# Altium project sonata-board.PrjPcb (part 2 of 4)

## Sheet sb-sonata-debug.SchDoc: FTDI Interface (Debug Programming)
size Letter; Organization: NewAE Technology Inc.; Address1: 1083 Queen St., Suite 196; Address2: Halifax; Address3: NS; Address4: Canada B3H 0B2; SheetNumber: 7; SheetTotal: 20; SheetApproved: NO
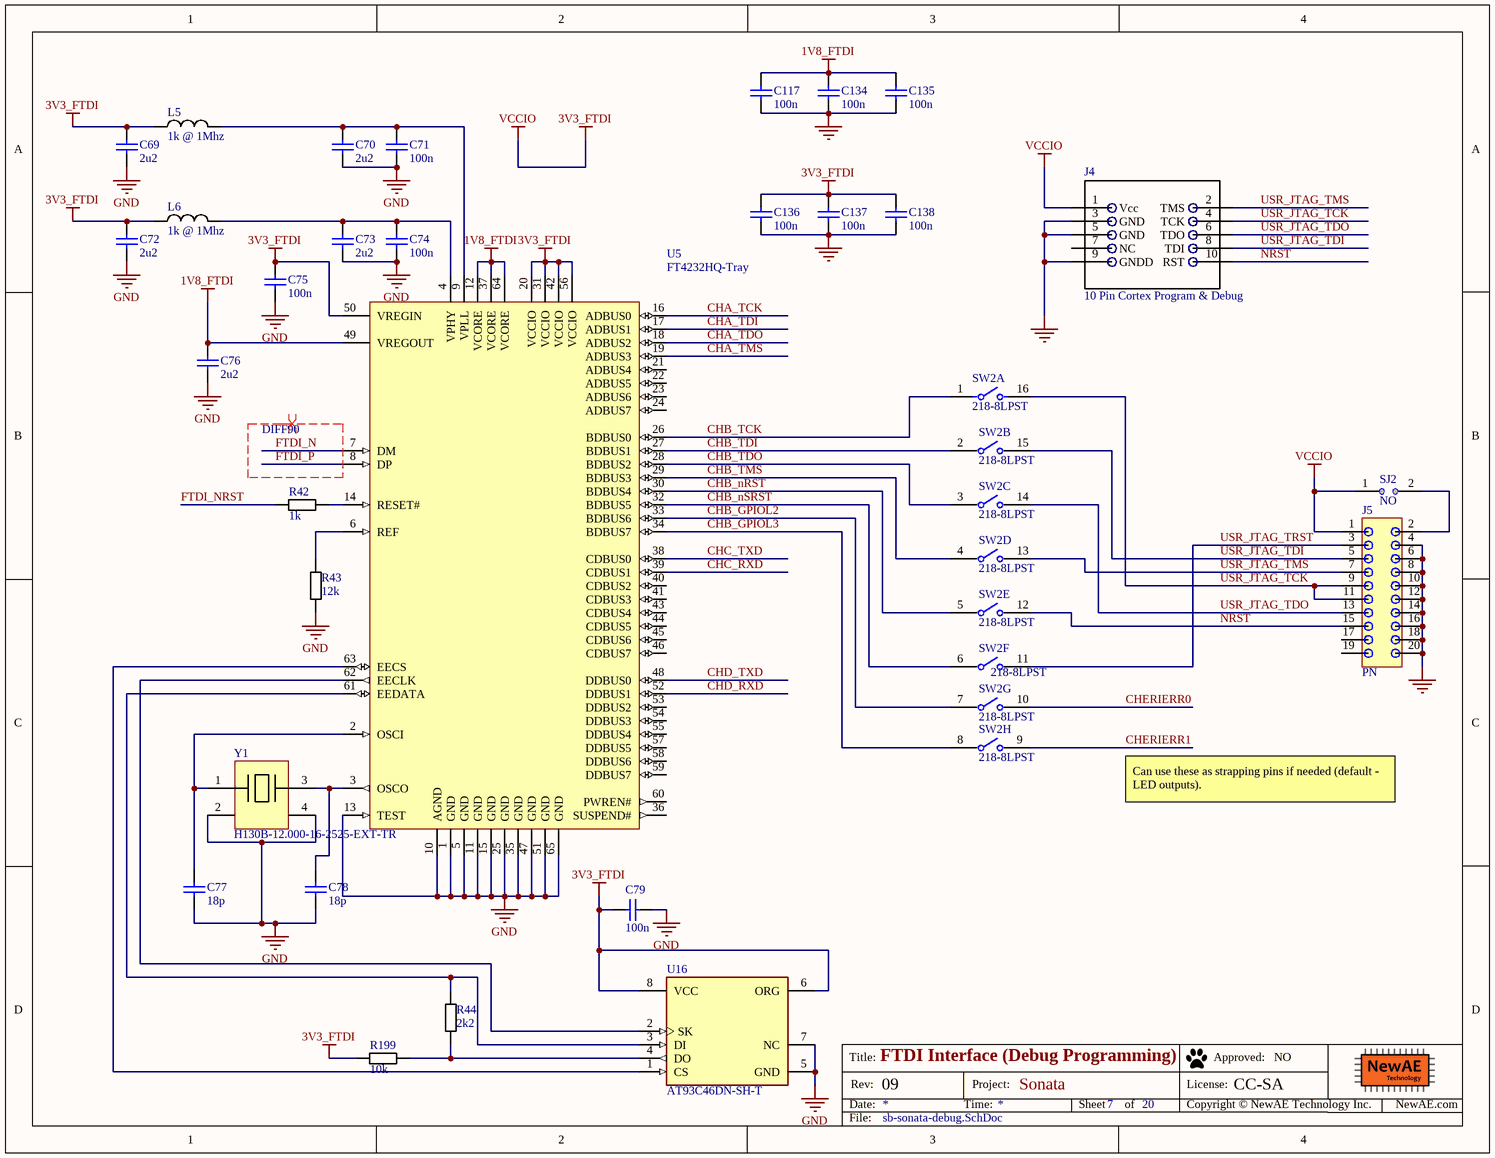
[diagram p6: sb-sonata-debug.SchDoc]

### Parts
C69  2u2  [CAPC0603_M]
C70  2u2  [CAPC0603_M]
C71  100n  [CAPC0402_M]
C72  2u2  [CAPC0603_M]
C73  2u2  [CAPC0603_M]
C74  100n  [CAPC0402_M]
C75  100n  [CAPC0402_M]
C76  2u2  [CAPC0603_M]
C77  18p  [CAPC0402_M]
C78  18p  [CAPC0402_M]
C79  100n  [CAPC0402_M]
C117  100n  [CAPC0402_M]
C134  100n  [CAPC0402_M]
C135  100n  [CAPC0402_M]
C136  100n  [CAPC0402_M]
C137  100n  [CAPC0402_M]
C138  100n  [CAPC0402_M]
J4  10 Pin Cortex Program & Debug  [0.5mm_SMD_Header_5x2]
J5  PN  [CONN_10x2_SHROUDED_2.54mm]
L5  1k @ 1Mhz  [IND_0603]
L6  1k @ 1Mhz  [IND_0603]
R42  1k  [RESC1005X40N]
R43  12k  [RESC1608X55N]
R44  2k2  [RESC1005X40N]
R199  10k  [RESC1005X40N]
SJ2  NO  [SJ_2S_NO]  (no BOM)
SW2  218-8LPST  [FP-218-8LPST-MFG]  (parts A,B,C,D,E,F,G,H of 8)
U5  FT4232HQ-Tray  [QFN64_2_N]
U16  AT93C46DN-SH-T  [FP-C04-057-SN-MFG]
Y1  H130B-12.000-16-2525-EXT-TR  [5x3.2MM XTAL]

### Nets
1V8_FTDI: C76.1 C117.1 C134.1 C135.1 U5.12(VCORE) U5.37(VCORE) U5.49(VREGOUT) U5.64(VCORE)
3V3_FTDI: C69.1 C72.1 C75.1 C79.1 C136.1 C137.1 C138.1 J4.1(Vcc) J5.1 L5.1 L6.1 R199.1 SJ2.1 U5.20(VCCIO) U5.31(VCCIO) U5.42(VCCIO) U5.50(VREGIN) U5.56(VCCIO) U16.6(ORG) U16.8(VCC)  [also labelled VCCIO]
GND: C69.2 C70.2 C71.2 C72.2 C73.2 C74.2 C75.2 C76.2 C77.2 C78.2 C79.2 C117.2 C134.2 C135.2 C136.2 C137.2 C138.2 J4.3(GND) J4.5(GND) J4.9(GNDD) J5.4 J5.6 J5.8 J5.10 J5.12 J5.14 J5.16 J5.18 J5.20 R43.2 U5.1(GND) U5.5(GND) U5.10(AGND) U5.11(GND) U5.13(TEST) U5.15(GND) U5.25(GND) U5.35(GND) U5.47(GND) U5.51(GND) U5.65(GND) U16.5(GND) U16.7(NC) Y1.2 Y1.4
CHA_TCK: U5.16(ADBUS0)
CHA_TDI: U5.17(ADBUS1)
CHA_TDO: U5.18(ADBUS2)
CHA_TMS: U5.19(ADBUS3)
CHB_GPIOL2: SW2.7 U5.33(BDBUS6)
CHB_GPIOL3: SW2.8 U5.34(BDBUS7)
CHB_nRST: SW2.5 U5.30(BDBUS4)
CHB_nSRST: SW2.6 U5.32(BDBUS5)
CHB_TCK: SW2.1 U5.26(BDBUS0)
CHB_TDI: SW2.2 U5.27(BDBUS1)
CHB_TDO: SW2.3 U5.28(BDBUS2)
CHB_TMS: SW2.4 U5.29(BDBUS3)
CHC_RXD: U5.39(CDBUS1)
CHC_TXD: U5.38(CDBUS0)
CHD_RXD: U5.52(DDBUS1)
CHD_TXD: U5.48(DDBUS0)
CHERIERR0: SW2.10
CHERIERR1: SW2.9
FTDI_N: U5.7(DM)
FTDI_NRST: R42.2
FTDI_P: U5.8(DP)
NRST: J4.10(RST) J5.15 SW2.12
USR_JTAG_TCK: J4.4(TCK) J5.9 J5.11 SW2.16
USR_JTAG_TDI: J4.8(TDI) J5.5 SW2.15
USR_JTAG_TDO: J4.6(TDO) J5.13 SW2.14
USR_JTAG_TMS: J4.2(TMS) J5.7 SW2.13
USR_JTAG_TRST: J5.3 SW2.11
NetC70_1: C70.1 C71.1 L5.2 U5.9(VPLL)
NetC73_1: C73.1 C74.1 L6.2 U5.4(VPHY)
NetC77_1: C77.1 U5.2(OSCI) Y1.1
NetC78_1: C78.1 U5.3(OSCO) Y1.3
NetJ5_2: J5.2 SJ2.2
NetR42_1: R42.1 U5.14(RESET#)
NetR43_1: R43.1 U5.6(REF)
NetR44_1: R44.1 U5.61(EEDATA) U16.3(DI)
NetR44_2: R44.2 R199.2 U16.4(DO)
NetU5_62: U5.62(EECLK) U16.2(SK)
NetU5_63: U5.63(EECS) U16.1(CS)

Not connected (* = marked no-connect by the designer): J4 7(NC); J5 17(9) 19(9); U5 21(ADBUS4) 22(ADBUS5) 23(ADBUS6) 24(ADBUS7) 36(SUSPEND#) 40(CDBUS2) 41(CDBUS3) 43(CDBUS4) 44(CDBUS5) 45(CDBUS6) 46(CDBUS7) 53(DDBUS2) 54(DDBUS3) 55(DDBUS4) 57(DDBUS5) 58(DDBUS6) 59(DDBUS7) 60(PWREN#)

### Layout directives
differential pair; differential pair class DIFF90: FTDI_N, FTDI_P

### Notes on the sheet
- Can use these as strapping pins if needed (default - LED outputs).
- Title:
- Date:
- Rev:
- Time:
- Project:
- Sheet
- of
- License:
- Copyright © NewAE Technology Inc.
- Approved:
- NewAE.com
- File:

### Library data of the parts
C69 C70 C72 C73 C76 = CCHIP-2u2-0603: 2u2, 0603; Manufacture 1: Samsung; Manufacture Part Number 1: CL10B225KP8NNNC; Component Group: Capacitor; Case-EIA: 0603; Case-Metric: 1608; Rated Voltage: 10VDC; Part Number: CCHIP-2u2-0603; Footprint: 0603; Pin Count: 2; Supplier 1: Digi-Key; Supplier Part Number 1: 1276-1134-1-ND; Value: 2u2; Mounting Technology: SMT; Component Kind: Standard; Component Type: Standard
C71 C74 C75 C79 C117 C134-C138 = CCHIP-100n-0402: as C4 on sheet sb-sonata-usb; Part Number: CCHIP-100n-0402; Footprint: 0402; Pin Count: 2; Supplier 1: Digi-Key; Supplier Part Number 1: 445-6901-1-ND; Value: 100n; Mounting Technology: SMT; Component Kind: Standard; Component Type: Standard
C77 C78 = CCHIP-18p-0402: 18p, 0402; Manufacture Part Number 1: GRM1555C1H180JA01D; Component Group: Capacitor; Case-EIA: 0402; Part Number: CCHIP-18p-0402; Footprint: 0402; Pin Count: 2; Supplier 1: Digi-Key; Supplier Part Number 1: 490-5858-1-ND; Value: 18p; Mounting Technology: SMT; Component Kind: Standard; Component Type: Standard
J4 = Cortex_Debug_Header_10Pin: 10 Pin Cortex Program & Debug 0.5mm pitch; Manufacture Part Number 1: 20021121-00010C4LF; Component Group: Connector; PP Material Stack: 0; Part Number: Cortex_Debug_Header_10Pin; Pin Count: 10; Supplier 1: Digi-Key; Supplier Part Number 1: 609-3695-1-ND; Mounting Technology: SMT; RoHS: Yes; Component Kind: Standard; Component Type: Standard; PP Rotation: 0
J5 = CONN20_2ROW: Header, 2-Row, 20-pin, 0.1"; Component Group: Connector; Part Number: CONN20_2ROW; Pin Count: 20; Mounting Technology: SMT; Component Kind: Standard; Component Type: Standard
L5 L6 = FBCHIP-1k-0603: Ferrite Beads HI CUR CHIP BD 0603 1000OHMS 25%; Manufacture 1: Taiyo Yuden; Manufacture Part Number 1: FBMH1608HM102-T / FBMH1608HM102-T / FBMH1608HM102-T / FBMH1608HM102-T; Component Group: Inductor; PP Material Stack: 0; Part Number: FBCHIP-1k-0603; Footprint: 0603; Pin Count: 2; Supplier 1: Mouser; Supplier Part Number 1: 963-FBMH1608HM102-T; Mounting Technology: SMT; RoHS: Yes; Component Kind: Standard; Component Type: Standard; PP Rotation: 0
R42 = RCHIP-1K-0402: 1k res, 0402, 1%, 1/16W; Manufacture 1: Yageo; Manufacture Part Number 1: RC0402FR-071KL; Component Group: Resistor; Case-EIA: 0402; Case-Metric: 1005; Rated Power: 0.063W; Rated Voltage: 75VDC; Part Number: RCHIP-1K-0402; Footprint: 0402; Pin Count: 2; Supplier 1: Digi-Key; Supplier Part Number 1: 311-1.00KLRCT-ND; Value: 1k; Tolerance: 1%; Mounting Technology: SMT; Temperature Range: -55C to 155C; Component Kind: Standard; Component Type: Standard
R43 = RCHIP-12K-0603: 12k res, 0603, 1%, 1/10W; Manufacture 1: Yageo; Manufacture Part Number 1: RC0603FR-0712KL; Component Group: Resistor; Case-EIA: 0603; Case-Metric: 1608; Rated Power: 0.1W; Rated Voltage: 75VDC; Part Number: RCHIP-12K-0603; Footprint: 0603; Pin Count: 2; Supplier 1: Digi-Key; Supplier Part Number 1: 311-12.0KHRCT-ND; Value: 12k; Tolerance: 1%; Mounting Technology: SMT; Temperature Range: -55C to 155C; Component Kind: Standard; Component Type: Standard
R44 = RCHIP-2K2-0402: 2k2 res, 0402, 1%, 1/16W; Manufacture 1: Yageo; Manufacture Part Number 1: RC0402FR-072K2L; Component Group: Resistor; Case-EIA: 0402; Case-Metric: 1005; Rated Power: 0.063W; Rated Voltage: 75VDC; Part Number: RCHIP-2K2-0402; Footprint: 0402; Pin Count: 2; Supplier 1: Digi-Key; Supplier Part Number 1: 311-2.20KLRCT-ND; Value: 2k2; Tolerance: 1%; Mounting Technology: SMT; Temperature Range: -55C to 155C; Component Kind: Standard; Component Type: Standard
R199 = RCHIP-10K-0402: as R3 on sheet sb-sonata-usb; Part Number: RCHIP-10K-0402; Footprint: 0402; Pin Count: 2; Supplier 1: Digi-Key; Supplier Part Number 1: 311-10.0KLRCT-ND; Value: 10k; Tolerance: 1%; Mounting Technology: SMT; Temperature Range: -55C to 155C; Component Kind: Standard; Component Type: Standard
SJ2 = SJ_2S_NO: Solder Jumper, NO; Component Group: PCB Feature; Part Number: SJ_2S_NO; Pin Count: 2; Mounting Technology: COPPER; Component Type: Standard (No BOM)
SW2 = CMP-07018-000007-1: SWITCH SLIDE DIP SPST 25MA 24V; Number of Positions: 8; Pitch: 0.05inch; Actuator Type: Slide (Standard); Electrical Life: 1000Cycles; Washable: Yes; Contact Resistance: 100mR; Radiation Hardening: No; Packaging: Rail/Tube; Length: 0.446inch; Depth: 8.44mm; Max Voltage Rating (DC): 24V; Lead Free: Lead Free; Mount: Surface Mount; RoHS Compliant: Yes; Series: 218; Max Operating Temperature: 85°C; Termination: Gull Wing; Voltage Rating (DC): 24V; Current Rating: 25mA; Contact Plating: Gold; Min Operating Temperature: -55°C; Terminal Pitch: 1.27mm; Contact Material: Copper; Throw Configuration: SPST; Orientation: Straight; Max Current Rating: 25mA; Height: 2.65mm; Package Quantity: 40
U5 = CMP-0078-00002-3: Quad High Speed USB To Multipurpose UART/MPSSE IC, 64-pin QFN, Tray; Manufacturer: FTDI; PackageDescription: 64-Pin Quad Flat No-Lead, 9 x 9 mm Body, 0.5 mm Pitch, 4.35 x 4.35 mm Exposed Pad; PackageVersion: Jan-12; ComponentLink2URL: http://www.ftdichip.com/Support/Documents/DataSheets/ICs/DS_FT4232H.pdf; RevisionNote: DatasheetVersion updated to 2.2 Jan-2012; ComponentLink1Description: Manufacturer URL; DatasheetVersion: ver 2.2, Jan-2012; PackageReference: QFN64_2; ComponentLink2Description: Datasheet; ComponentLink1URL: http://www.ftdichip.com/; PartNumber: FT4232HQ-Tray
U16 = CMP-06313-000016-1: IC EEPROM 1K SPI 2MHZ 8SOIC; Manufacturer: Microchip; Nominal Supply Current: 0.5mA; Memory Size: 1Kbits; Access Time: 1000ns; Max Supply Voltage: 5.5V; Interface: Other; Standoff Height: 0.1mm; Min Supply Voltage: 1.8V; Category: IC; Temperature Range High: +85°C; Mouser Description: EEPROM Serial-3Wire 1K-Bit 128 x 8/64 x 16 2.5V/3.3V/5V 8-Pin SOIC T/R; Ipc Land Pattern Name: SOIC127P600X175-8; Temperature Range Low: -40°C; Temperature: -40°C to +85°C; Digikey Description: IC EEPROM 1K SPI 2MHZ 8SOIC; Lead Free: Yes; Device Class L2: Memory; ComponentLink2URL: http://ww1.microchip.com/downloads/en/DeviceDoc/20006224B.pdf; Automotive: No; Device Class L3: EEPROM; Package: C04-057-SN; Octopart: https://octopart.com/at93c46dn-sh-t-microchip-77759177; RoHS: TRUE; Memory Type: EEPROM; Height: 1.75mm; Manufacturer Part Number: AT93C46DN-SH-T; ComponentLink2Description: Datasheet; Frequency: 2MHz; Device Class L1: Integrated Circuits (ICs)
Y1 = H130B-12.000-16-2525-EXT-TR: 12MHz ±25ppm Crystal 16pF 35 Ohms 4-SMD, No Lead; Manufacture 1: Raltron Electronics; Value: 12.000MHz; PP Material Stack: 0; Supplier 1: Digi-Key; Stock 1: 4955; Pricing 1: 1=0.590000, 10=0.488000, 50=0.439400, 100=0.390600, 500=0.371100 (USD); Supplier Part Number 1: 2151-H130B-12.000-16-2525-EXT-TR-ND; .Checked SCH: *; .Checked PCB: *; Manufacturer Part Number: H130B-12.000-16-2525-EXT-TR; Part Number: H130B-12.000-16-2525-EXT-TR; Component Group: Crystal; Footprint: 5x3.2mm; Manufacture Part Number 1: H130B-12.000-16-2525-EXT-TR; Pin Count: 4; Mounting Technology: SMT; Component Kind: Standard; Component Type: Standard; PP Rotation: 0

## Sheet sb-sonata-led.SchDoc: LEDs and Switches
size Letter; Organization: NewAE Technology Inc.; Address1: 1083 Queen St., Suite 196; Address2: Halifax; Address3: NS; Address4: Canada B3H 0B2; SheetNumber: 8; SheetTotal: 20; SheetApproved: NO
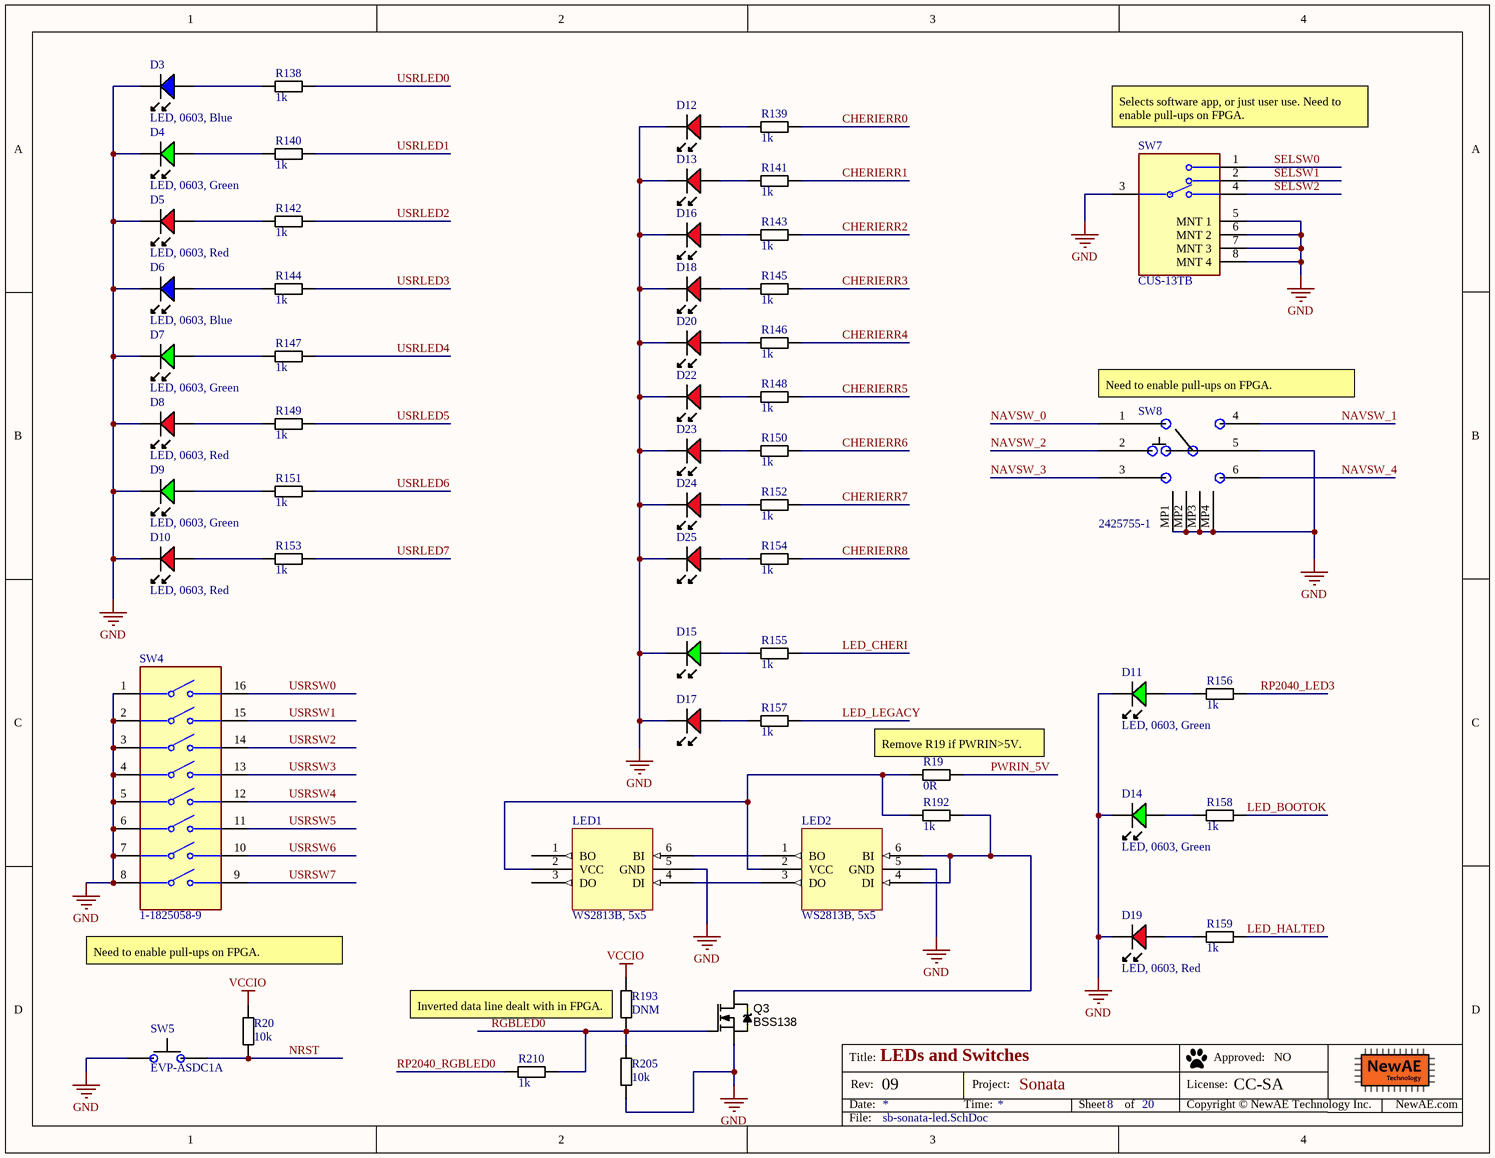
[diagram p7: sb-sonata-led.SchDoc]

### Parts
D3  LED, 0603, Blue  [LED-0603-BLUE]
D4  LED, 0603, Green  [LED-0603-GREEN]
D5  LED, 0603, Red  [LED-0603-RED]
D6  LED, 0603, Blue  [LED-0603-BLUE]
D7  LED, 0603, Green  [LED-0603-GREEN]
D8  LED, 0603, Red  [LED-0603-RED]
D9  LED, 0603, Green  [LED-0603-GREEN]
D10  LED, 0603, Red  [LED-0603-RED]
D11  LED, 0603, Green  [LED-0603-GREEN]
D12  LED, 0603, Red  [LED-0603-RED]  (value not drawn)
D13  LED, 0603, Red  [LED-0603-RED]  (value not drawn)
D14  LED, 0603, Green  [LED-0603-GREEN]
D15  LED, 0603, Green  [LED-0603-GREEN]  (value not drawn)
D16  LED, 0603, Red  [LED-0603-RED]  (value not drawn)
D17  LED, 0603, Red  [LED-0603-RED]  (value not drawn)
D18  LED, 0603, Red  [LED-0603-RED]  (value not drawn)
D19  LED, 0603, Red  [LED-0603-RED]
D20  LED, 0603, Red  [LED-0603-RED]  (value not drawn)
D22  LED, 0603, Red  [LED-0603-RED]  (value not drawn)
D23  LED, 0603, Red  [LED-0603-RED]  (value not drawn)
D24  LED, 0603, Red  [LED-0603-RED]  (value not drawn)
D25  LED, 0603, Red  [LED-0603-RED]  (value not drawn)
LED1  WS2813B, 5x5  [WS2813B_5x5]
LED2  WS2813B, 5x5  [WS2813B_5x5]
Q3  BSS138  [SOT95P245X110-3M]
R19  0R  [RESC1608X55N]
R20  10k  [RESC1005X40N]
R138  1k  [RESC1005X40N]
R139  1k  [RESC1005X40N]
R140  1k  [RESC1005X40N]
R141  1k  [RESC1005X40N]
R142  1k  [RESC1005X40N]
R143  1k  [RESC1005X40N]
R144  1k  [RESC1005X40N]
R145  1k  [RESC1005X40N]
R146  1k  [RESC1005X40N]
R147  1k  [RESC1005X40N]
R148  1k  [RESC1005X40N]
R149  1k  [RESC1005X40N]
R150  1k  [RESC1005X40N]
R151  1k  [RESC1005X40N]
R152  1k  [RESC1005X40N]
R153  1k  [RESC1005X40N]
R154  1k  [RESC1005X40N]
R155  1k  [RESC1005X40N]
R156  1k  [RESC1005X40N]
R157  1k  [RESC1005X40N]
R158  1k  [RESC1005X40N]
R159  1k  [RESC1005X40N]
R192  1k  [RESC1005X40N]
R193  DNM  [RESC1005X40N]
R205  10k  [RESC1005X40N]
R210  1k  [RESC1005X40N]
SW4  1-1825058-9  [FP-1-1825058-9-MFG]
SW5  EVP-ASDC1A  [EVPAS]
SW7  CUS-13TB  [FP-CUS-13TB-MFG]
SW8  2425755-1  [2425755-1]

### Nets
GND: D3.K D4.K D5.K D6.K D7.K D8.K D9.K D10.K D11.K D12.K D13.K D14.K D15.K D16.K D17.K D18.K D19.K D20.K D22.K D23.K D24.K D25.K LED1.5(GND) LED2.5(GND) Q3.2(S) R205.2 SW4.1 SW4.2 SW4.3 SW4.4 SW4.5 SW4.6 SW4.7 SW4.8 SW5.1(IN) SW7.3(C) SW7.5(MNT_1) SW7.6(MNT_2) SW7.7(MNT_3) SW7.8(MNT_4) SW8.5 SW8.MP1 SW8.MP2 SW8.MP3 SW8.MP4
VCCIO: R20.1 R193.1  [project net 3V3_FTDI]
CHERIERR0: R139.1
CHERIERR1: R141.1
CHERIERR2: R143.1
CHERIERR3: R145.1
CHERIERR4: R146.1
CHERIERR5: R148.1
CHERIERR6: R150.1
CHERIERR7: R152.1
CHERIERR8: R154.1
LED_BOOTOK: R158.1
LED_CHERI: R155.1
LED_HALTED: R159.1
LED_LEGACY: R157.1
NAVSW_0: SW8.1
NAVSW_1: SW8.4
NAVSW_2: SW8.2
NAVSW_3: SW8.3
NAVSW_4: SW8.6
NRST: R20.2 SW5.2(IN)
PWRIN_5V: R19.2
RGBLED0: Q3.1(G) R193.2 R205.1 R210.1
RP2040_LED3: R156.1
RP2040_RGBLED0: R210.2
SELSW0: SW7.1
SELSW1: SW7.2
SELSW2: SW7.4
USRLED0: R138.1
USRLED1: R140.1
USRLED2: R142.1
USRLED3: R144.1
USRLED4: R147.1
USRLED5: R149.1
USRLED6: R151.1
USRLED7: R153.1
USRSW0: SW4.16
USRSW1: SW4.15
USRSW2: SW4.14
USRSW3: SW4.13
USRSW4: SW4.12
USRSW5: SW4.11
USRSW6: SW4.10
USRSW7: SW4.9
NetD3_A: D3.A R138.2
NetD4_A: D4.A R140.2
NetD5_A: D5.A R142.2
NetD6_A: D6.A R144.2
NetD7_A: D7.A R147.2
NetD8_A: D8.A R149.2
NetD9_A: D9.A R151.2
NetD10_A: D10.A R153.2
NetD11_A: D11.A R156.2
NetD12_A: D12.A R139.2
NetD13_A: D13.A R141.2
NetD14_A: D14.A R158.2
NetD15_A: D15.A R155.2
NetD16_A: D16.A R143.2
NetD17_A: D17.A R157.2
NetD18_A: D18.A R145.2
NetD19_A: D19.A R159.2
NetD20_A: D20.A R146.2
NetD22_A: D22.A R148.2
NetD23_A: D23.A R150.2
NetD24_A: D24.A R152.2
NetD25_A: D25.A R154.2
NetLED1_2: LED1.2(VCC) LED2.2(VCC) R19.1 R192.1
NetLED1_4: LED1.4(DI) LED2.3(DO)
NetLED1_6: LED1.6(BI) LED2.1(BO)
NetLED2_4: LED2.4(DI) LED2.6(BI) Q3.3(D) R192.2

Not connected (* = marked no-connect by the designer): LED1 1(BO) 3(DO)

### Notes on the sheet
- (near SW7) Selects software app, or just user use. Need to enable pull-ups on FPGA.
- (near SW8) Need to enable pull-ups on FPGA.
- (near R19) Remove R19 if PWRIN>5V.
- Need to enable pull-ups on FPGA.
- (near R193) Inverted data line dealt with in FPGA.
- Title:
- Date:
- Rev:
- Time:
- Project:
- Sheet
- of
- License:
- Copyright © NewAE Technology Inc.
- Approved:
- NewAE.com
- File:

### Library data of the parts
D3 D6 = LEDCHIP_0603_BLUE: Chip LED, Blue; Manufacture 1: Kingbright; Manufacture Part Number 1: APT1608QBC/D; Component Group: Optical; Part Number: LEDCHIP_0603_BLUE; Pin Count: 2; Supplier 1: Digi-Key; Supplier Part Number 1: 754-1434-1-ND; Mounting Technology: SMT; Component Kind: Standard; Component Type: Standard
D4 D7 D9 D11 D14 D15 = LEDCHIP_0603_GREEN: Chip LED, Green; Manufacture 1: Kingbright; Manufacture Part Number 1: APT1608CGCK; Component Group: Optical; PP Material Stack: 16; PP Rotation: -90; Part Number: LEDCHIP_0603_GREEN; Pin Count: 2; Supplier 1: Digi-Key; Supplier Part Number 1: 754-1116-1-ND; Mounting Technology: SMT; Component Kind: Standard; Component Type: Standard
D5 D8 D10 D12 D13 D16-D20 D22-D25 = LEDCHIP_0603_RED: Chip LED, Red; Manufacture 1: Kingbright; Manufacture Part Number 1: APT1608SURCK; Component Group: Optical; PP Material Stack: 15; PP Rotation: -90; Part Number: LEDCHIP_0603_RED; Pin Count: 2; Supplier 1: Digi-Key; Supplier Part Number 1: 754-1123-1-ND; Mounting Technology: SMT; Component Kind: Standard; Component Type: Standard
LED1 LED2 = WS2813B_5x5: WS2813B, 5x5 SMD Neopixel; Manufacture 1: Seeed Studio; Manufacture Part Number 1: 601000200; Component Group: Optical; PP Material Stack: 0; Part Number: WS2813B_5x5; Footprint: 5x5mm SMD; Pin Count: 6; Component Kind: Standard; Component Type: Standard; PP Rotation: 0; PP Rotation1: 0
Q3 = DMN3200U-7: MOSFET N-CH 30V 2.2A SOT23-3; Rated Power: 0.22A; PP Material Stack: 0; Part Number: BSS138; Component Group: MOSFET; Footprint: SOT23; Manufacture Part Number 1: BSS138; Pin Count: 3; Supplier 1: Digi-Key; Rated Voltage: 30V; Mounting Technology: SMT; RoHS: Yes; Component Kind: Standard; Component Type: Standard; PP Rotation: 0
R19 = RCHIP-0R-0603: 0R, 0603, 1/10W; Manufacture 1: Yageo; Manufacture Part Number 1: RC0603FR-070RL; Component Group: Resistor; Case-EIA: 0603; Case-Metric: 1608; Rated Power: 0.1W; Rated Voltage: 75VDC; Tolerance: 1%; Part Number: RCHIP-0R-0603; Footprint: 0603; Pin Count: 2; Supplier 1: Digi-Key; Supplier Part Number 1: 311-0.0HRCT-ND; Value: 0R; Mounting Technology: SMT; Temperature Range: -55C to 155C; Component Kind: Standard; Component Type: Standard
R20 R205 = RCHIP-10K-0402: as R3 on sheet sb-sonata-usb; Part Number: RCHIP-10K-0402; Footprint: 0402; Pin Count: 2; Supplier 1: Digi-Key; Supplier Part Number 1: 311-10.0KLRCT-ND; Value: 10k; Tolerance: 1%; Mounting Technology: SMT; Temperature Range: -55C to 155C; Component Kind: Standard; Component Type: Standard
R138-R159 R192 R210 = RCHIP-1K-0402: as R42 on sheet sb-sonata-debug; Part Number: RCHIP-1K-0402; Footprint: 0402; Pin Count: 2; Supplier 1: Digi-Key; Supplier Part Number 1: 311-1.00KLRCT-ND; Value: 1k; Tolerance: 1%; Mounting Technology: SMT; Temperature Range: -55C to 155C; Component Kind: Standard; Component Type: Standard
R193 = RCHIP-DNM-0402: Component Group: Resistor; Case-EIA: 0402; Case-Metric: 1005; Part Number: RCHIP-DNM-0402; Footprint: 0402; Pin Count: 2; Value: DNM; Component Kind: Standard; Component Type: Standard
SW4 = CMP-03400-000015-1: SWITCH SLIDE DIP SPST 100MA 24V; Manufacturer: TE Connectivity; Current Rating: 1A; Electromechanical Life: 1000Cycles; Contact Resistance: 50mΩ; Number Of Circuits: 8; Device Class L1: Electromechanical; Manufacturer Part Number: 1-1825058-9; Height: 5.1mm; ComponentLink2Description: Datasheet; Temperature Range High: +85°C; Digikey Description: SWITCH SLIDE DIP SPST 100MA 24V; Voltage Rating Dc: 24V; Package: 0; Automotive: No; ComponentLink2URL: https://www.te.com/commerce/DocumentDelivery/DDEController?Action=showdoc&DocId=Customer+Drawing%7F1825058%7FS5%7Fpdf%7FEnglish%7FENG_CD_1825058_S5.pdf%7F1-1825058-9; Octopart: https://octopart.com/1-1825058-9-te+connectivity-46507285; Temperature Range Low: -30°C; Device Class L2: Switches; Contact Current Rating: 100mA; Mount: Surface Mount; Temperature: -30°C to +85°C; Category: Switch; Device Class L3: DIP Switches; Lead Free: Yes; Throw Configuration: SPST; RoHS: TRUE
SW5 = EVP-ASDC1A: Pushbutton, SMD, 2.5NM force, NO; Manufacture 1: Panasonic; Component Group: Switch; Part Number: EVP-ASDC1A; Manufacture Part Number 1: EVP-ASDC1A; Pin Count: 2; Supplier 1: Digi-Key; Supplier Part Number 1: P16856CT-ND; Mounting Technology: SMT; Component Kind: Standard; Component Type: Standard
SW7 = CMP-71745-000014-1: SWITCH SLIDE SP3T 300MA 4V; Actuator Length: 1.5mm; Electrical Life: 10000Cycles; Max Voltage Rating (DC): 20V; Switch Function: On-On-On; Actuator Material: Nylon; Actuator Type: Standard; Contact Style: Non-Shorting; Contact Plating: Gold; Termination: Gull Wing; Radiation Hardening: No; Series: CUS; Max Operating Temperature: 70°C; Mount: Surface Mount; Switch Travel: 1.5mm; Packaging: Tape and Reel; Min Operating Temperature: -20°C; Contact Material: Copper Alloy; Orientation: Right Angle; Voltage Rating (DC): 4V; RoHS Compliant: Yes; Current Rating: 300mA; Throw Configuration: SP3T
SW8 = 2425755-1: 5-Way Joystick; Manufacture 1: TE; Component Group: Switch; PP Material Stack: 0; Part Number: 2425755-1; Manufacture Part Number 1: 2425755-1; Pin Count: 10; Supplier 1: Digi-Key; Component Kind: Standard; Component Type: Standard; PP Rotation: 0; PP Rotation1: 0

## Sheet sb-sonata-microsd.SchDoc: MicroSD Card Connector
size Letter; Organization: NewAE Technology Inc.; Address1: 1083 Queen St., Suite 196; Address2: Halifax; Address3: NS; Address4: Canada B3H 0B2; SheetNumber: 9; SheetTotal: 20; SheetApproved: YES
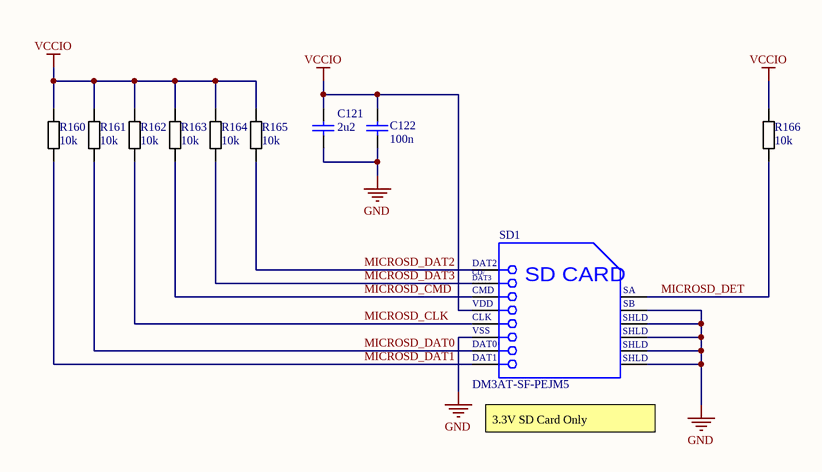
[diagram p8: sb-sonata-microsd.SchDoc]

### Parts
C121  2u2  [CAPC0603_M]
C122  100n  [CAPC0402_M]
R160  10k  [RESC1005X40N]
R161  10k  [RESC1005X40N]
R162  10k  [RESC1005X40N]
R163  10k  [RESC1005X40N]
R164  10k  [RESC1005X40N]
R165  10k  [RESC1005X40N]
R166  10k  [RESC1005X40N]
SD1  DM3AT-SF-PEJM5  [FP-DM3AT-SF-PEJM5-MFG]

### Nets
GND: C121.2 C122.2 SD1.6(VSS) SD1.10(SB) SD1.11(SHLD) SD1.12(SHLD) SD1.13(SHLD) SD1.14(SHLD)
VCCIO: C121.1 C122.1 R160.2 R161.2 R162.2 R163.2 R164.2 R165.2 R166.2 SD1.4(VDD)  [project net 3V3_FTDI]
MICROSD_CLK: R162.1 SD1.5(CLK)
MICROSD_CMD: R163.1 SD1.3(CMD)
MICROSD_DAT0: R161.1 SD1.7(DAT0)
MICROSD_DAT1: R160.1 SD1.8(DAT1)
MICROSD_DAT2: R165.1 SD1.1(DAT2)
MICROSD_DAT3: R164.1 SD1.2(CD/DAT3)
MICROSD_DET: R166.1 SD1.9(SA)

### Notes on the sheet
- (near SD1) 3.3V SD Card Only
- Title:
- Date:
- Rev:
- Time:
- Project:
- Sheet
- of
- License:
- Copyright © NewAE Technology Inc.
- Approved:
- NewAE.com
- File:
- (in symbol CMP-2000-05150-1) CD/; DAT3; SD CARD

### Library data of the parts
C121 = CCHIP-2u2-0603: as C69 on sheet sb-sonata-debug; Part Number: CCHIP-2u2-0603; Footprint: 0603; Pin Count: 2; Supplier 1: Digi-Key; Supplier Part Number 1: 1276-1134-2-ND; Value: 2u2; Mounting Technology: SMT; Component Kind: Standard; Component Type: Standard
C122 = CCHIP-100n-0402: as C4 on sheet sb-sonata-usb; Part Number: CCHIP-100n-0402; Footprint: 0402; Pin Count: 2; Supplier 1: Digi-Key; Supplier Part Number 1: 445-6901-1-ND; Value: 100n; Mounting Technology: SMT; Component Kind: Standard; Component Type: Standard
R160-R166 = RCHIP-10K-0402: as R3 on sheet sb-sonata-usb; Part Number: RCHIP-10K-0402; Footprint: 0402; Pin Count: 2; Supplier 1: Digi-Key; Supplier Part Number 1: 311-10.0KLRCT-ND; Value: 10k; Tolerance: 1%; Mounting Technology: SMT; Temperature Range: -55C to 155C; Component Kind: Standard; Component Type: Standard
SD1 = CMP-2000-05150-1: Micro SD Card Connector, 0.5 A, 125 V, -25 to 85 degC, 8-Pin SMD, RoHS, Tape and Reel; Manufacturer: Hirose Electric; Featured Product: DM3ATSeries; HTML Datasheet: DM3SeriesmicroSD.html; Other Names: HR1964DKR; Connector Type: ConnectorandEjector; Insertion, Removal Method: PushIn,PushOut; Card Type: SecureDigital-microSD™; Online Catalog: DM3Series; Number of Positions: 10(8+2); Product Training Modules: DM3SeriesmicroSDCardSockets; Manufacturer URL: https://www.hirose.com; Contact Finish: Gold; Height Above Board: 0.066"(1.68mm); Family: MemoryConnectors-PCCardSockets; Package Reference: DM3AT-8; Category: Connectors,Interconnects; Features: Switch; Mounting Type: SurfaceMount,RightAngle; Datasheet Version: Jun-10; Package Description: 8-Pin Surface Mount Device, Body 16.15 x 13.85 mm, Pitch 1.1 mm; Standard Package: 1; Contact Finish Thickness: -; Datasheet URL: https://ciiva.com/datasheet-click-46418261?src=ciiva&sig=4019062a; Mounting Feature: Normal,Standard-Top; Series: DM3; Packaging: Digi-Reel; Package URL: https://www.hirose.com/product/en/download_file/key_name/DM3/category/Catalog/doc_file_id/49662/?file_category_id=4&item_id=195&is_series=1; Ejector Side: -

## Sheet sb-sonata-ethmac.SchDoc: Ethernet MAC (SPI)
size Letter; Organization: NewAE Technology Inc.; Address1: 1083 Queen St., Suite 196; Address2: Halifax; Address3: NS; Address4: Canada B3H 0B2; SheetNumber: 10; SheetTotal: 20; SheetApproved: YES
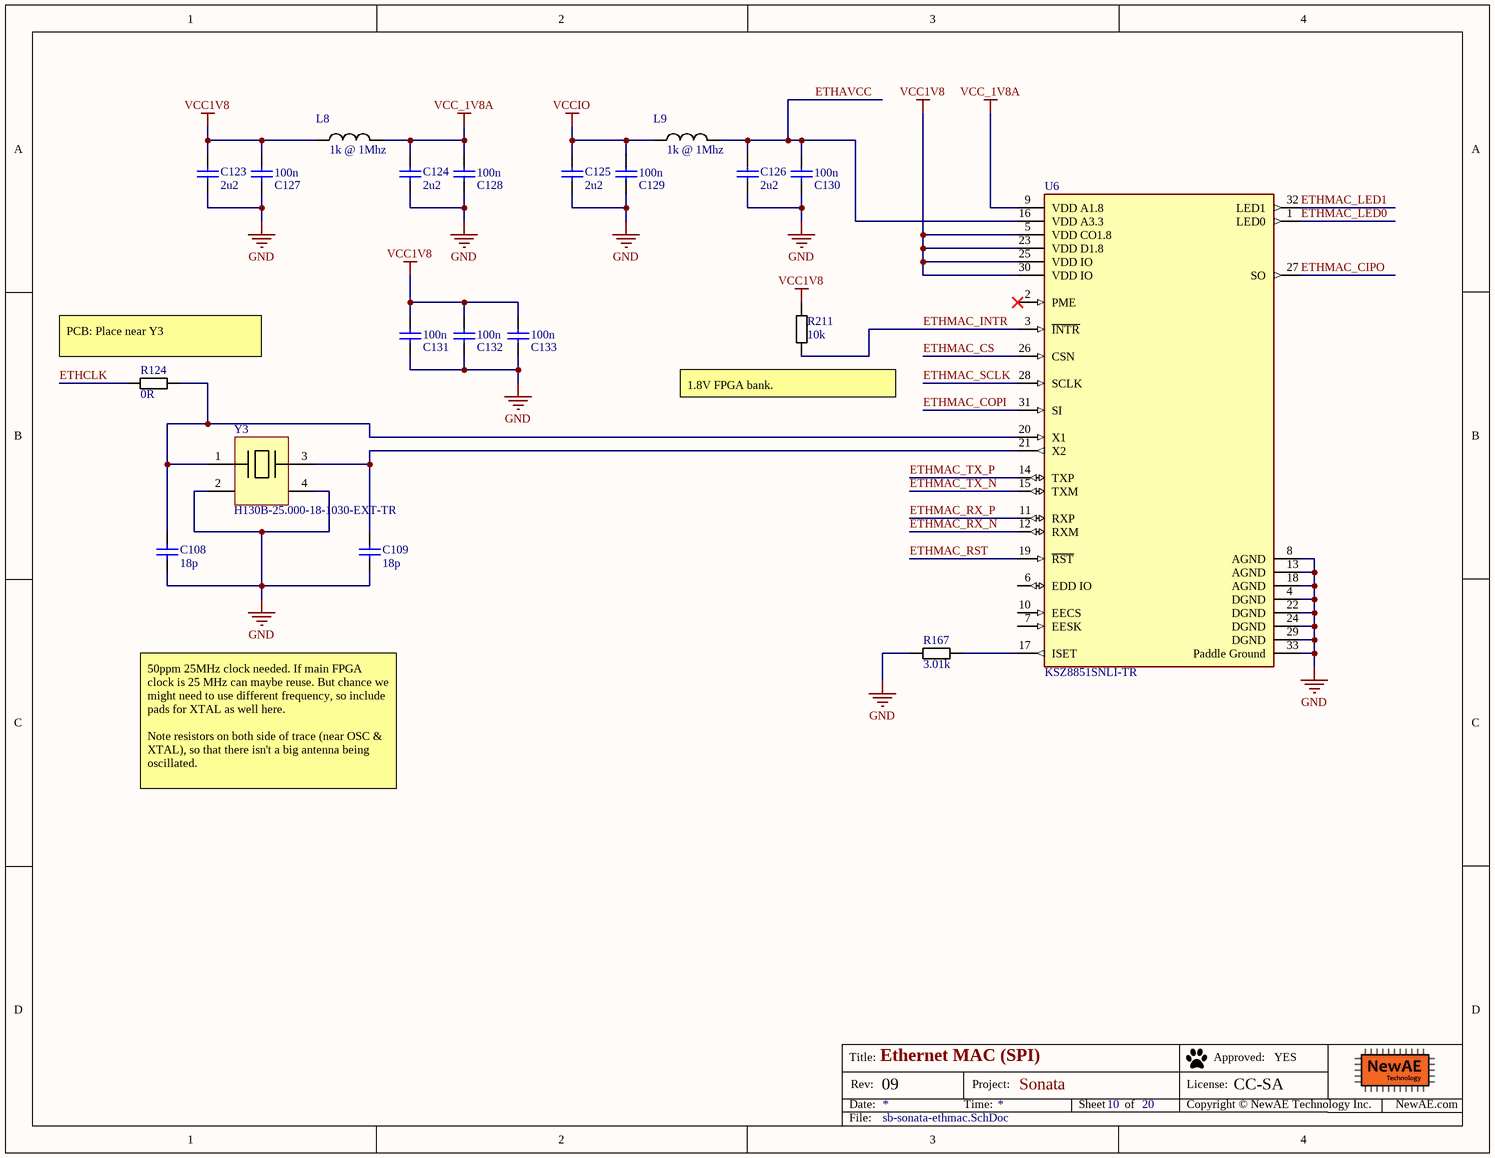
[diagram p9: sb-sonata-ethmac.SchDoc]

### Parts
C108  18p  [CAPC0402_M]
C109  18p  [CAPC0402_M]
C123  2u2  [CAPC0603_M]
C124  2u2  [CAPC0603_M]
C125  2u2  [CAPC0603_M]
C126  2u2  [CAPC0603_M]
C127  100n  [CAPC0402_M]
C128  100n  [CAPC0402_M]
C129  100n  [CAPC0402_M]
C130  100n  [CAPC0402_M]
C131  100n  [CAPC0402_M]
C132  100n  [CAPC0402_M]
C133  100n  [CAPC0402_M]
L8  1k @ 1Mhz  [IND_0603]
L9  1k @ 1Mhz  [IND_0603]
R124  0R  [RESC1608X55N]
R167  3.01k  [RESC1005X40N]
R211  10k  [RESC1005X40N]
U6  KSZ8851SNLI-TR  [FP-QFN55-32LD-PL-5-IPC_C]
Y3  Manufacturer Part Number: H130B-25.000-18-1030-EXT-TR  [5x3.2MM XTAL]  (hidden comment: H130B-12.000-16-2525-EXT-TR)

### Nets
GND: C108.2 C109.2 C123.2 C124.2 C125.2 C126.2 C127.2 C128.2 C129.2 C130.2 C131.2 C132.2 C133.2 R167.1 U6.4(DGND) U6.8(AGND) U6.13(AGND) U6.18(AGND) U6.22(DGND) U6.24(DGND) U6.29(DGND) U6.33(Paddle_Ground) Y3.2 Y3.4
VCC1V8: C123.1 C127.1 C131.1 C132.1 C133.1 L8.1 R211.1 U6.5(VDD_CO1.8) U6.23(VDD_D1.8) U6.25(VDD_IO) U6.30(VDD_IO)
VCC_1V8A: C124.1 C128.1 L8.2 U6.9(VDD_A1.8)
VCCIO: C125.1 C129.1 L9.1  [project net 3V3_FTDI]
ETHAVCC: C126.1 C130.1 L9.2 U6.16(VDD_A3.3)
ETHCLK: R124.1
ETHMAC_CIPO: U6.27(SO)
ETHMAC_COPI: U6.31(SI)
ETHMAC_CS: U6.26(CSN)
ETHMAC_INTR: R211.2 U6.3(~{INTR})
ETHMAC_LED0: U6.1(LED0)
ETHMAC_LED1: U6.32(LED1)
ETHMAC_RST: U6.19(~{RST})
ETHMAC_RX_N: U6.12(RXM)
ETHMAC_RX_P: U6.11(RXP)
ETHMAC_SCLK: U6.28(SCLK)
ETHMAC_TX_N: U6.15(TXM)
ETHMAC_TX_P: U6.14(TXP)
NetC108_1: C108.1 R124.2 U6.20(X1) Y3.1
NetC109_1: C109.1 U6.21(X2) Y3.3
NetR167_2: R167.2 U6.17(ISET)

Not connected (* = marked no-connect by the designer): U6 2(PME)* 6(EDD_IO) 7(EESK) 10(EECS)

### Notes on the sheet
- (near R124) PCB: Place near Y3
- (near R211) 1.8V FPGA bank.
- 50ppm 25MHz clock needed. If main FPGA clock is 25 MHz can maybe reuse. But chance we might need to use different frequency, so include pads for XTAL as well here.
  Note resistors on both side of trace (near OSC & XTAL), so that there isn't a big antenna being oscillated.
- Title:
- Date:
- Rev:
- Time:
- Project:
- Sheet
- of
- License:
- Copyright © NewAE Technology Inc.
- Approved:
- NewAE.com
- File:

### Library data of the parts
C108 C109 = CCHIP-18p-0402: as C77 on sheet sb-sonata-debug; Part Number: CCHIP-18p-0402; Footprint: 0402; Pin Count: 2; Supplier 1: Digi-Key; Supplier Part Number 1: 490-5858-1-ND; Value: 18p; Mounting Technology: SMT; Component Kind: Standard; Component Type: Standard
C123-C126 = CCHIP-2u2-0603: as C69 on sheet sb-sonata-debug; Part Number: CCHIP-2u2-0603; Footprint: 0603; Pin Count: 2; Supplier 1: Digi-Key; Supplier Part Number 1: 1276-1134-1-ND; Value: 2u2; Mounting Technology: SMT; Component Kind: Standard; Component Type: Standard
C127-C133 = CCHIP-100n-0402: 100n, 0402; Component Group: Capacitor; Case-EIA: 0402; Part Number: CCHIP-100n-0402; Footprint: 0402; Pin Count: 2; Value: 100n; Mounting Technology: SMT; Component Kind: Standard; Component Type: Standard; Supplier 1: Digi-Key; Supplier Part Number 1: 445-6901-1-ND
L8 L9 = FBCHIP-1k-0603: as L5 on sheet sb-sonata-debug; Part Number: FBCHIP-1k-0603; Footprint: 0603; Pin Count: 2; Supplier 1: Mouser; Supplier Part Number 1: 963-FBMH1608HM102-T; Mounting Technology: SMT; RoHS: Yes; Component Kind: Standard; Component Type: Standard; PP Rotation: 0
R124 = RCHIP-0R-0603: as R19 on sheet sb-sonata-led; Part Number: RCHIP-0R-0603; Footprint: 0603; Pin Count: 2; Supplier 1: Digi-Key; Supplier Part Number 1: 311-0.0HRCT-ND; Value: 0R; Mounting Technology: SMT; Temperature Range: -55C to 155C; Component Kind: Standard; Component Type: Standard
R167 = RCHIP-3K01-0402: 3k01 res, 0402, 1%, 1/16W; Manufacture 1: Yageo; Manufacture Part Number 1: RC0402FR-073K01L; Component Group: Resistor; Case-EIA: 0402; Case-Metric: 1005; Rated Power: 0.063W; Rated Voltage: 75VDC; Part Number: RCHIP-3K01-0402; Footprint: 0402; Pin Count: 2; Supplier 1: Digi-Key; Supplier Part Number 1: 311-3.01KLRCT-ND; Value: 3.01k; Tolerance: 1%; Mounting Technology: SMT; Temperature Range: -55C to 155C; Component Kind: Standard; Component Type: Standard
R211 = RCHIP-10K-0402: as R3 on sheet sb-sonata-usb; Part Number: RCHIP-10K-0402; Footprint: 0402; Pin Count: 2; Supplier 1: Digi-Key; Supplier Part Number 1: 311-10.0KLRCT-ND; Value: 10k; Tolerance: 1%; Mounting Technology: SMT; Temperature Range: -55C to 155C; Component Kind: Standard; Component Type: Standard
U6 = CMP-2000-06522-2: IC ETHERNET CTLR 1PORT PCI 32MLF; Data Rate: 100Mbps; Interface: SPI; Nominal Supply Current: 75mA; Max Supply Voltage: 3.5V; Number of Functions: 1; Operating Supply Voltage: 3.3V; Min Supply Voltage: 3.1V; Max Supply Current: 85mA; Height: 0.85mm; Package Quantity: 1000; Series: -; Max Operating Temperature: 85°C; Packaging: Tape and Reel; Case/Package: QFN; Radiation Hardening: No; Lead Free: Lead Free; REACH SVHC: No SVHC; Number of Transceivers: 1; Number of Pins: 32; Min Operating Temperature: -40°C; Supply Current: 75mA; Length: 5mm; Width: 5mm; Supply Voltage-Nom: 3.3V; Number of Ports: 1; Mount: Surface Mount
Y3 = H130B-12.000-16-2525-EXT-TR: 12MHz ±25ppm Crystal 16pF 35 Ohms 4-SMD, No Lead; Manufacture 1: Raltron Electronics; Value: 25.000MHz; PP Material Stack: 0; Supplier 1: Digi-Key; Stock 1: 4955; Pricing 1: 1=0.590000, 10=0.488000, 50=0.439400, 100=0.390600, 500=0.371100 (USD); Supplier Part Number 1: 2151-H130B-12.000-16-2525-EXT-TR-ND; .Checked SCH: *; .Checked PCB: *; Part Number: H130B-25.000-18-1030-EXT-TR; Component Group: Crystal; Footprint: 5x3.2mm; Manufacture Part Number 1: H130B-25.000-18-1030-EXT-TR; Pin Count: 4; Mounting Technology: SMT; Component Kind: Standard; Component Type: Standard; PP Rotation: 0

## Sheet sb-sonata-fpga.SchDoc: FPGA Config & Misc
size Letter; Organization: NewAE Technology Inc.; Address1: 1083 Queen St., Suite 196; Address2: Halifax; Address3: NS; Address4: Canada B3H 0B2; SheetNumber: 11; SheetTotal: 20; SheetApproved: YES
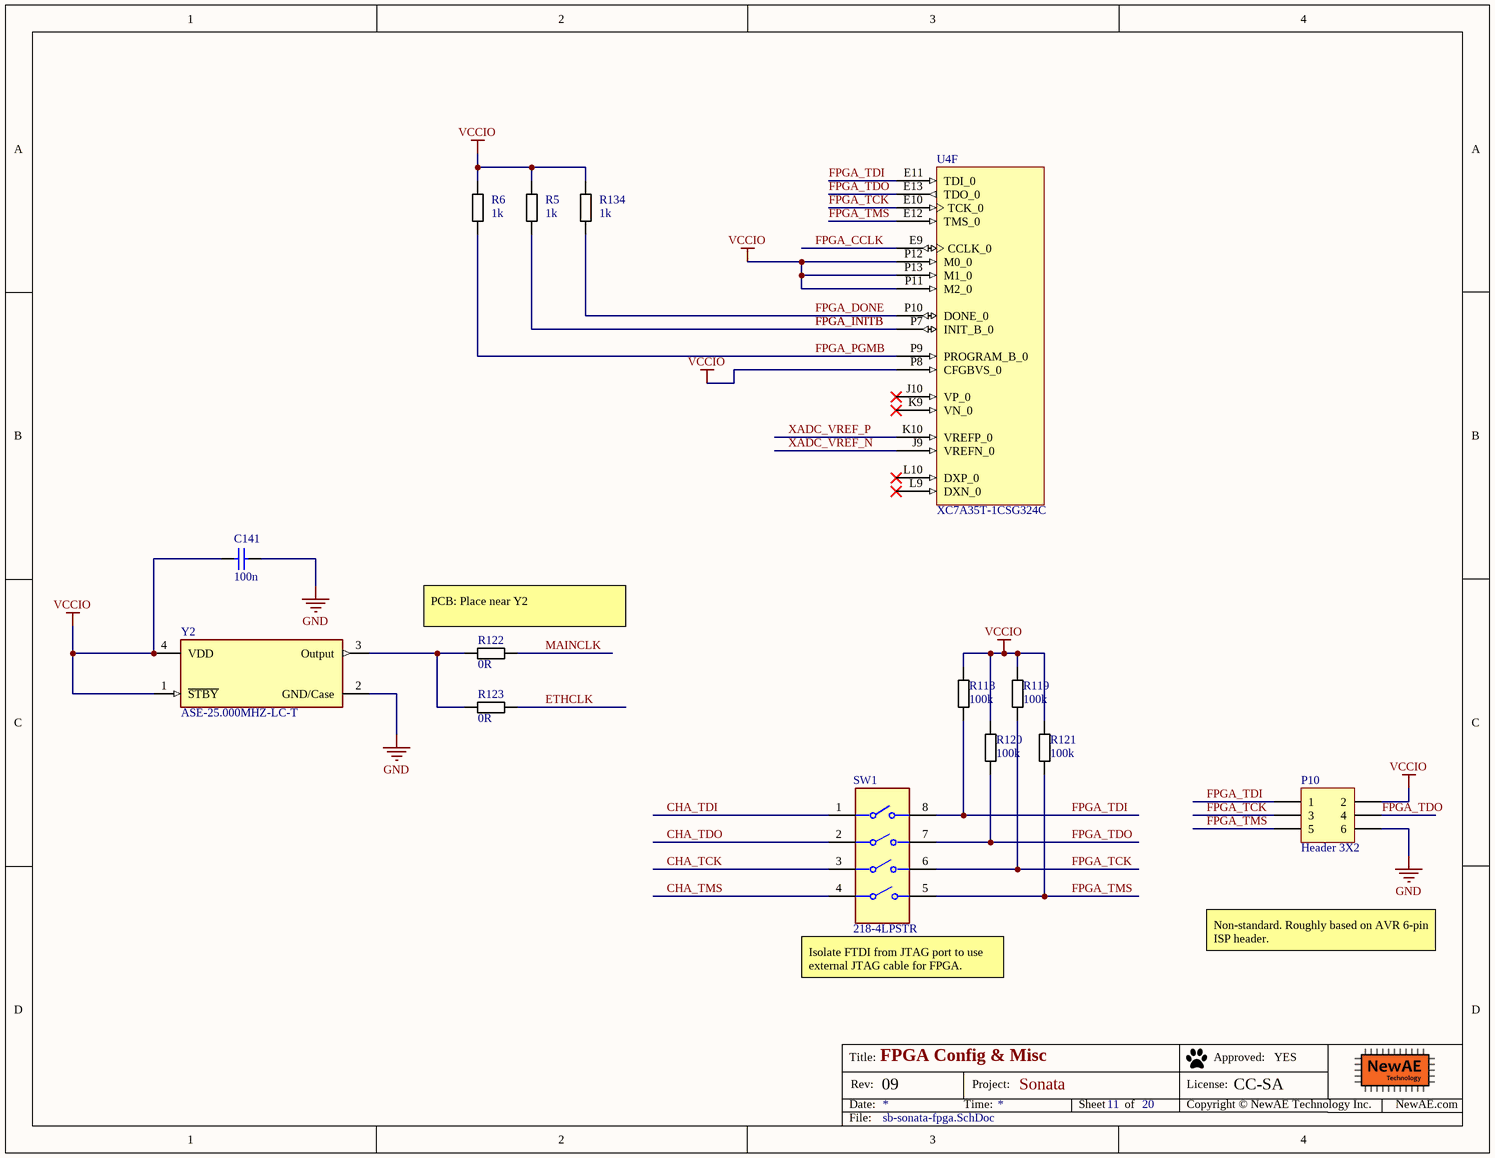
[diagram p10: sb-sonata-fpga.SchDoc]

### Parts
C141  100n  [CAPC0402_M]
P10  Header 3X2  [HDR2X3]
R5  1k  [RESC1608X55N]
R6  1k  [RESC1608X55N]
R118  100k  [RESC1005X40N]
R119  100k  [RESC1005X40N]
R120  100k  [RESC1005X40N]
R121  100k  [RESC1005X40N]
R122  0R  [RESC1608X55N]
R123  0R  [RESC1608X55N]
R134  1k  [RESC1608X55N]
SW1  218-4LPSTR  [FP-218-4LPSTR-MFG]
U4  XC7A35T-1CSG324C  [CSG324]  (part F of 9)
Y2  ASE-25.000MHZ-LC-T  [FP-ASE-MFG]

### Nets
GND: C141.2 P10.6 Y2.2(GND/Case)
VCCIO: C141.1 P10.2 R5.1 R6.1 R118.1 R119.1 R120.1 R121.1 R134.1 U4.P8(CFGBVS_0) U4.P11(M2_0) U4.P12(M0_0) U4.P13(M1_0) Y2.1(~{STBY}) Y2.4(VDD)  [project net 3V3_FTDI]
CHA_TCK: SW1.3
CHA_TDI: SW1.1
CHA_TDO: SW1.2
CHA_TMS: SW1.4
ETHCLK: R123.2
FPGA_CCLK: U4.E9(CCLK_0)
FPGA_DONE: R134.2 U4.P10(DONE_0)
FPGA_INITB: R5.2 U4.P7(INIT_B_0)
FPGA_PGMB: R6.2 U4.P9(PROGRAM_B_0)
FPGA_TCK: P10.3 R119.2 SW1.6 U4.E10(TCK_0)
FPGA_TDI: P10.1 R118.2 SW1.8 U4.E11(TDI_0)
FPGA_TDO: P10.4 R120.2 SW1.7 U4.E13(TDO_0)
FPGA_TMS: P10.5 R121.2 SW1.5 U4.E12(TMS_0)
MAINCLK: R122.2
XADC_VREF_N: U4.J9(VREFN_0)
XADC_VREF_P: U4.K10(VREFP_0)
NetR122_1: R122.1 R123.1 Y2.3(Output)

Not connected (* = marked no-connect by the designer): U4 J10(VP_0)* K9(VN_0)* L9(DXN_0)* L10(DXP_0)*

### Notes on the sheet
- (near R122) PCB: Place near Y2
- (near SW1) Isolate FTDI from JTAG port to use external JTAG cable for FPGA.
- Non-standard. Roughly based on AVR 6-pin ISP header.
- Title:
- Date:
- Rev:
- Time:
- Project:
- Sheet
- of
- License:
- Copyright © NewAE Technology Inc.
- Approved:
- NewAE.com
- File:

### Library data of the parts
C141 = CCHIP-100n-0402: as C4 on sheet sb-sonata-usb; Part Number: CCHIP-100n-0402; Footprint: 0402; Pin Count: 2; Supplier 1: Digi-Key; Supplier Part Number 1: 445-6901-1-ND; Value: 100n; Mounting Technology: SMT; Component Kind: Standard; Component Type: Standard
P10 = Header 3X2: Header, 3-Pin, Dual row; LatestRevisionDate: 17-Jul-2002; LatestRevisionNote: Re-released for DXP Platform.; Publisher: Altium Limited
R5 R6 R134 = RCHIP-1K-0603: 1k res, 0603, 1%, 1/10W; Manufacture 1: Yageo; Manufacture Part Number 1: RC0603FR-071KL; Component Group: Resistor; Case-EIA: 0603; Case-Metric: 1608; Rated Power: 0.1W; Rated Voltage: 75VDC; Part Number: RCHIP-1K-0603; Footprint: 0603; Pin Count: 2; Supplier 1: Digi-Key; Supplier Part Number 1: 311-1.00KHRCT-ND; Value: 1k; Tolerance: 1%; Mounting Technology: SMT; Temperature Range: -55C to 155C; Component Kind: Standard; Component Type: Standard
R118-R121 = RCHIP-100K-0402: 100k res, 0402, 1%, 1/16W; Manufacture 1: Yageo; Manufacture Part Number 1: RC0402FR-07100KL; Component Group: Resistor; Case-EIA: 0402; Case-Metric: 1005; Rated Power: 0.063W; Rated Voltage: 75VDC; Part Number: RCHIP-100K-0402; Footprint: 0402; Pin Count: 2; Supplier 1: Digi-Key; Supplier Part Number 1: 311-100KLRCT-ND; Value: 100k; Tolerance: 1%; Mounting Technology: SMT; Temperature Range: -55C to 155C; Component Kind: Standard; Component Type: Standard
R122 R123 = RCHIP-0R-0603: as R19 on sheet sb-sonata-led; Part Number: RCHIP-0R-0603; Footprint: 0603; Pin Count: 2; Supplier 1: Digi-Key; Supplier Part Number 1: 311-0.0HRCT-ND; Value: 0R; Mounting Technology: SMT; Temperature Range: -55C to 155C; Component Kind: Standard; Component Type: Standard
SW1 = CMP-07018-000008-1: SWITCH SLIDE DIP SPST 25MA 24V; Number of Positions: 4; Washable: Yes; Pitch: 0.05inch; Actuator Type: Slide (Standard); Electrical Life: 1000Cycles; Current Rating: 25mA; Contact Material: Copper; Max Current Rating: 25mA; Termination: Gull Wing; Throw Configuration: SPST; Mount: Surface Mount; Radiation Hardening: No; Contact Plating: Gold; Length: 0.246inch; Depth: 8.44mm; Package Quantity: 2000; Packaging: Tape and Reel; Series: 218; Lead Free: Lead Free; Voltage Rating (DC): 24V; Min Operating Temperature: -55°C; RoHS Compliant: Yes; Mechanical Life: 1000Cycles; Max Operating Temperature: 85°C; Orientation: Straight; Max Voltage Rating (DC): 24V
U4 = CMP-0383-00012-1: Artix-7 FPGA, 210 User I/Os, 0 GTP, 324-Ball BGA, Speed Grade 1, Commercial Grade, Pb-Free; Manufacturer: Xilinx; GTP: 0; Available User I/O: 210; Speed Grades: 1; Logic Cells: 33280; Total Block RAM: 1800 Kb; CMTs: 5; Maximum Distributed RAM: 400 Kb; ComponentLink2URL: http://www.xilinx.com/support/documentation/data_sheets/ds180_7Series_Overview.pdf; ComponentLink2Description: Datasheet; DatasheetVersion: Rev. 1.15; PackageDescription: 324-Ball Wire-Bond Chip-Scale BGA, Body 15 x 15 mm, Pitch 0.8 mm; ComponentLink4URL: http://www.xilinx.com/support/documentation/user_guides/ug475_7Series_Pkg_Pinout.pdf; PackageReference: CSG-324; Mounting Technology: Surface Mount; PackageVersion: Rev. 1.11; ComponentLink1Description: Manufacturer URL; ComponentLink3Description: Pinout; ComponentLink1URL: http://www.xilinx.com/; ComponentLink3URL: http://www.xilinx.com/support/documentation/user_guides/ug475_7Series_Pkg_Pinout.pdf; PartNumber: XC7A35T-1CSG324C; ComponentLink4Description: Package Specification; Operating Temperature Range: Commercial
Y2 = CMP-2000-05795-3: XTAL Oscillator 25MHz ±50ppm CMOS 3.3V 4-SMD 3.2mm x 2.5mm; Load Capacitance: 15pF; Min Supply Voltage: 3.135V; Max Supply Voltage: 3.465V; Max Supply Current: 13mA; Max Operating Temperature: 85°C; Termination: SMD/SMT; Operating Frequency: 25 MHz; Height: 0.047inch; Frequency: 25MHz; Mount: Surface Mount; Number of Pins: 4; Length: 3.2mm; Packaging: Tape and Reel; Frequency Stability: 50ppm; Series: ASE; Radiation Hardening: No; Package Quantity: 1000; Width: 2.5mm; Min Operating Temperature: -40°C; Lead Free: Lead Free; Case/Package: SMD/SMT; Depth: 2.5mm; Operating Supply Voltage: 3.3V

## Sheet sb-sonata-fpgaio1.SchDoc: IO Banks 14+34 + Flash
size Letter; Organization: NewAE Technology Inc.; Address1: 1083 Queen St., Suite 196; Address2: Halifax; Address3: NS; Address4: Canada B3H 0B2; SheetNumber: 12; SheetTotal: 20; SheetApproved: YES
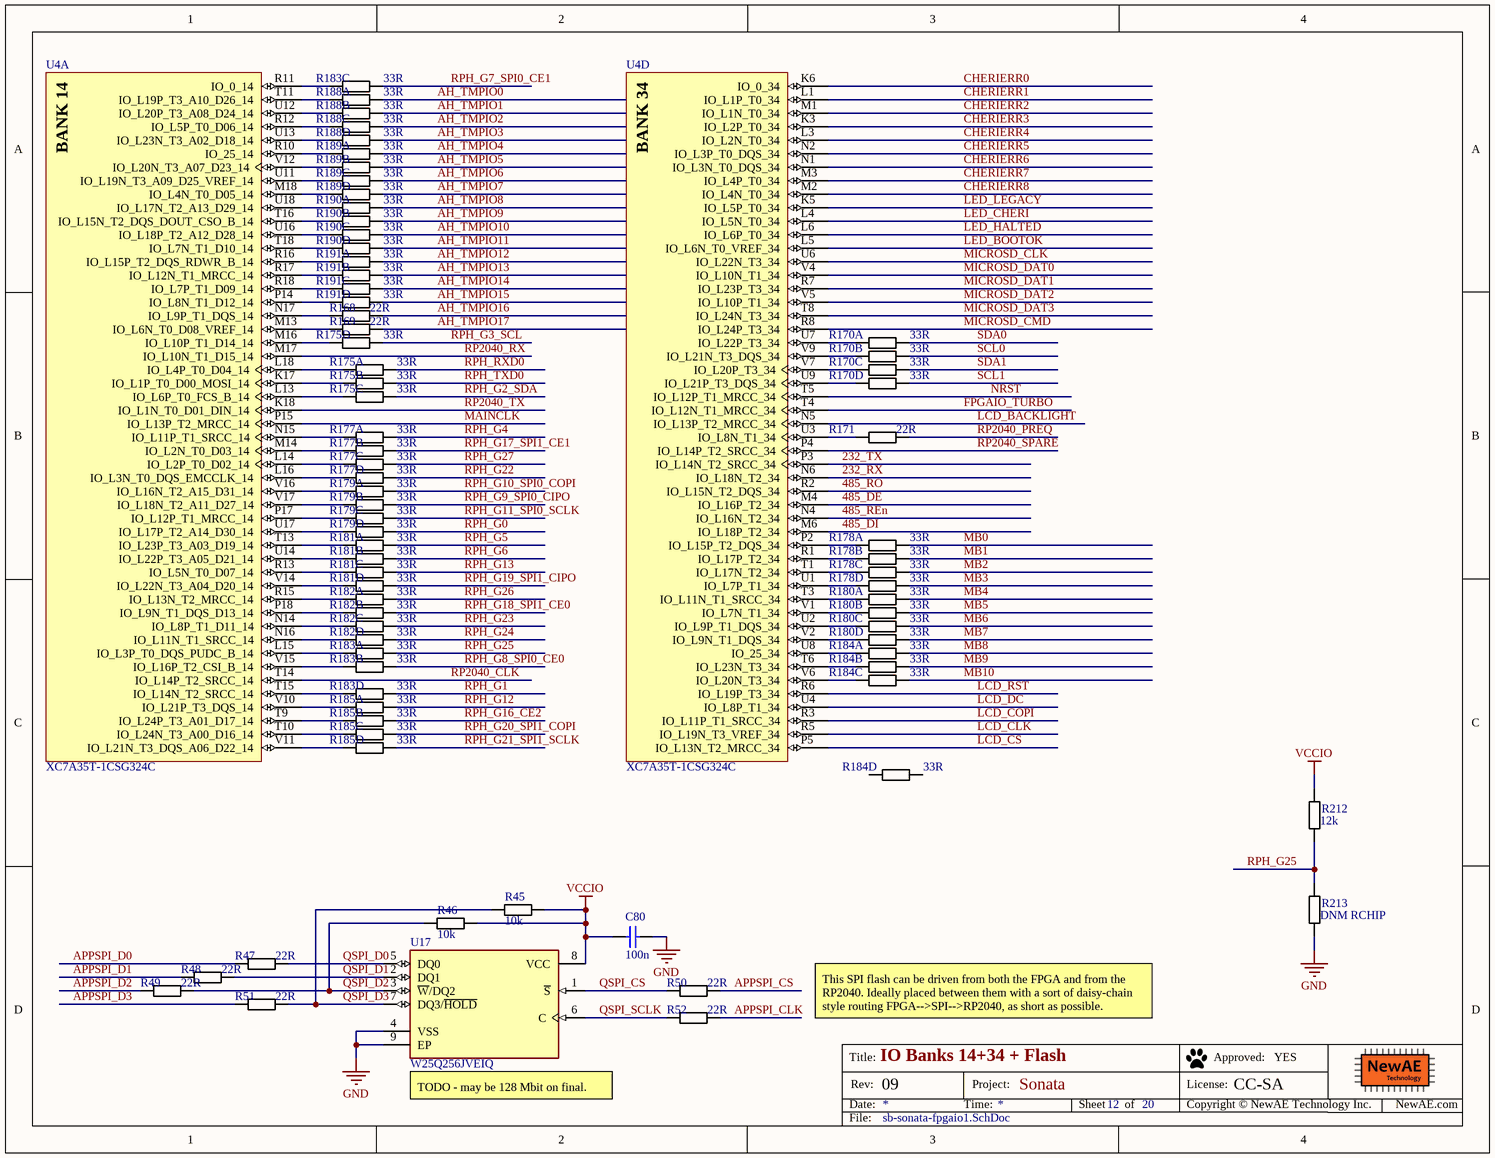
[diagram p11: sb-sonata-fpgaio1.SchDoc]

### Parts
C80  100n  [CAPC0402_M]
R45  10k  [RESC1005X40N]
R46  10k  [RESC1005X40N]
R47  22R  [RESC1005X40N]
R48  22R  [RESC1005X40N]
R49  22R  [RESC1005X40N]
R50  22R  [RESC1005X40N]
R51  22R  [RESC1005X40N]
R52  22R  [RESC1005X40N]
R168  22R  [RESC1005X40N]
R169  22R  [RESC1005X40N]
R170  33R  [741C083]  (parts A,B,C,D of 4)
R171  22R  [RESC1005X40N]
R175  33R  [741C083]  (parts A,B,C,D of 4)
R177  33R  [741C083]  (parts A,B,C,D of 4)
R178  33R  [741C083]  (parts A,B,C,D of 4)
R179  33R  [741C083]  (parts A,B,C,D of 4)
R180  33R  [741C083]  (parts A,B,C,D of 4)
R181  33R  [741C083]  (parts A,B,C,D of 4)
R182  33R  [741C083]  (parts A,B,C,D of 4)
R183  33R  [741C083]  (parts A,B,C,D of 4)
R184  33R  [741C083]  (parts A,B,C,D of 4)
R185  33R  [741C083]  (parts A,B,C,D of 4)
R188  33R  [741C083]  (parts A,B,C,D of 4)
R189  33R  [741C083]  (parts A,B,C,D of 4)
R190  33R  [741C083]  (parts A,B,C,D of 4)
R191  33R  [741C083]  (parts A,B,C,D of 4)
R212  12k  [RESC1608X55N]
R213  DNM RCHIP  [RESC1608X55N]
U4  XC7A35T-1CSG324C  [CSG324]  (parts A,D of 9)
U17  W25Q256JVEIQ  [WSON68_Micron]

### Nets
GND: C80.2 R213.1 U17.4(VSS) U17.9(EP)
VCCIO: C80.1 R45.1 R46.1 R212.2 U17.8(VCC)  [project net 3V3_FTDI]
232_RX: U4.N6(IO_L18N_T2_34)
232_TX: U4.P3(IO_L14N_T2_SRCC_34)
485_DE: U4.M4(IO_L16P_T2_34)
485_DI: U4.M6(IO_L18P_T2_34)
485_REn: U4.N4(IO_L16N_T2_34)
485_RO: U4.R2(IO_L15N_T2_DQS_34)
AH_TMPIO0: R188.1B
AH_TMPIO1: R188.2B
AH_TMPIO2: R188.3B
AH_TMPIO3: R188.4B
AH_TMPIO4: R189.1B
AH_TMPIO5: R189.2B
AH_TMPIO6: R189.3B
AH_TMPIO7: R189.4B
AH_TMPIO8: R190.1B
AH_TMPIO9: R190.2B
AH_TMPIO10: R190.3B
AH_TMPIO11: R190.4B
AH_TMPIO12: R191.1B
AH_TMPIO13: R191.2B
AH_TMPIO14: R191.3B
AH_TMPIO15: R191.4B
AH_TMPIO16: R168.2
AH_TMPIO17: R169.2
APPSPI_CLK: R52.2
APPSPI_CS: R50.2
APPSPI_D0: R47.1
APPSPI_D1: R48.1
APPSPI_D2: R49.1
APPSPI_D3: R51.1
CHERIERR0: U4.K6(IO_0_34)
CHERIERR1: U4.L1(IO_L1P_T0_34)
CHERIERR2: U4.M1(IO_L1N_T0_34)
CHERIERR3: U4.K3(IO_L2P_T0_34)
CHERIERR4: U4.L3(IO_L2N_T0_34)
CHERIERR5: U4.N2(IO_L3P_T0_DQS_34)
CHERIERR6: U4.N1(IO_L3N_T0_DQS_34)
CHERIERR7: U4.M3(IO_L4P_T0_34)
CHERIERR8: U4.M2(IO_L4N_T0_34)
FPGAIO_TURBO: U4.T4(IO_L12N_T1_MRCC_34)
LCD_BACKLIGHT: U4.N5(IO_L13P_T2_MRCC_34)
LCD_CLK: U4.R5(IO_L19N_T3_VREF_34)
LCD_COPI: U4.R3(IO_L11P_T1_SRCC_34)
LCD_CS: U4.P5(IO_L13N_T2_MRCC_34)
LCD_DC: U4.U4(IO_L8P_T1_34)
LCD_RST: U4.R6(IO_L19P_T3_34)
LED_BOOTOK: U4.L5(IO_L6N_T0_VREF_34)
LED_CHERI: U4.L4(IO_L5N_T0_34)
LED_HALTED: U4.L6(IO_L6P_T0_34)
LED_LEGACY: U4.K5(IO_L5P_T0_34)
MAINCLK: U4.P15(IO_L13P_T2_MRCC_14)
MB0: R178.1B
MB1: R178.2B
MB2: R178.3B
MB3: R178.4B
MB4: R180.1B
MB5: R180.2B
MB6: R180.3B
MB7: R180.4B
MB8: R184.1B
MB9: R184.2B
MB10: R184.3B
MICROSD_CLK: U4.U6(IO_L22N_T3_34)
MICROSD_CMD: U4.R8(IO_L24P_T3_34)
MICROSD_DAT0: U4.V4(IO_L10N_T1_34)
MICROSD_DAT1: U4.R7(IO_L23P_T3_34)
MICROSD_DAT2: U4.V5(IO_L10P_T1_34)
MICROSD_DAT3: U4.T8(IO_L24N_T3_34)
NRST: U4.T5(IO_L12P_T1_MRCC_34)
QSPI_CS: R50.1 U17.1(~{S})
QSPI_D0: R47.2 U17.5(DQ0)
QSPI_D1: R48.2 U17.2(DQ1)
QSPI_D2: R46.2 R49.2 U17.3(~{W}/DQ2)
QSPI_D3: R45.2 R51.2 U17.7(DQ3/~{HOLD})
QSPI_SCLK: R52.1 U17.6(C)
RP2040_CLK: U4.T14(IO_L14P_T2_SRCC_14)
RP2040_PREQ: R171.2
RP2040_RX: U4.M17(IO_L10N_T1_D15_14)
RP2040_SPARE: U4.P4(IO_L14P_T2_SRCC_34)
RP2040_TX: U4.K18(IO_L1N_T0_D01_DIN_14)
RPH_G0: R179.4B
RPH_G1: R183.4B
RPH_G2_SDA: R175.3B
RPH_G3_SCL: R175.4B
RPH_G4: R177.1B
RPH_G5: R181.1B
RPH_G6: R181.2B
RPH_G7_SPI0_CE1: R183.3B
RPH_G8_SPI0_CE0: R183.2B
RPH_G9_SPI0_CIPO: R179.2B
RPH_G10_SPI0_COPI: R179.1B
RPH_G11_SPI0_SCLK: R179.3B
RPH_G12: R185.1B
RPH_G13: R181.3B
RPH_G16_CE2: R185.2B
RPH_G17_SPI1_CE1: R177.2B
RPH_G18_SPI1_CE0: R182.2B
RPH_G19_SPI1_CIPO: R181.4B
RPH_G20_SPI1_COPI: R185.3B
RPH_G21_SPI1_SCLK: R185.4B
RPH_G22: R177.4B
RPH_G23: R182.3B
RPH_G24: R182.4B
RPH_G25: R183.1B R212.1 R213.2
RPH_G26: R182.1B
RPH_G27: R177.3B
RPH_RXD0: R175.1B
RPH_TXD0: R175.2B
SCL0: R170.2B
SCL1: R170.4B
SDA0: R170.1B
SDA1: R170.3B
NetR168_1: R168.1 U4.N17(IO_L9P_T1_DQS_14)
NetR169_1: R169.1 U4.M13(IO_L6N_T0_D08_VREF_14)
NetR170_1A: R170.1A U4.U7(IO_L22P_T3_34)
NetR170_2A: R170.2A U4.V9(IO_L21N_T3_DQS_34)
NetR170_3A: R170.3A U4.V7(IO_L20P_T3_34)
NetR170_4A: R170.4A U4.U9(IO_L21P_T3_DQS_34)
NetR171_1: R171.1 U4.U3(IO_L8N_T1_34)
NetR175_1A: R175.1A U4.L18(IO_L4P_T0_D04_14)
NetR175_2A: R175.2A U4.K17(IO_L1P_T0_D00_MOSI_14)
NetR175_3A: R175.3A U4.L13(IO_L6P_T0_FCS_B_14)
NetR175_4A: R175.4A U4.M16(IO_L10P_T1_D14_14)
NetR177_1A: R177.1A U4.N15(IO_L11P_T1_SRCC_14)
NetR177_2A: R177.2A U4.M14(IO_L2N_T0_D03_14)
NetR177_3A: R177.3A U4.L14(IO_L2P_T0_D02_14)
NetR177_4A: R177.4A U4.L16(IO_L3N_T0_DQS_EMCCLK_14)
NetR178_1A: R178.1A U4.P2(IO_L15P_T2_DQS_34)
NetR178_2A: R178.2A U4.R1(IO_L17P_T2_34)
NetR178_3A: R178.3A U4.T1(IO_L17N_T2_34)
NetR178_4A: R178.4A U4.U1(IO_L7P_T1_34)
NetR179_1A: R179.1A U4.V16(IO_L16N_T2_A15_D31_14)
NetR179_2A: R179.2A U4.V17(IO_L18N_T2_A11_D27_14)
NetR179_3A: R179.3A U4.P17(IO_L12P_T1_MRCC_14)
NetR179_4A: R179.4A U4.U17(IO_L17P_T2_A14_D30_14)
NetR180_1A: R180.1A U4.T3(IO_L11N_T1_SRCC_34)
NetR180_2A: R180.2A U4.V1(IO_L7N_T1_34)
NetR180_3A: R180.3A U4.U2(IO_L9P_T1_DQS_34)
NetR180_4A: R180.4A U4.V2(IO_L9N_T1_DQS_34)
NetR181_1A: R181.1A U4.T13(IO_L23P_T3_A03_D19_14)
NetR181_2A: R181.2A U4.U14(IO_L22P_T3_A05_D21_14)
NetR181_3A: R181.3A U4.R13(IO_L5N_T0_D07_14)
NetR181_4A: R181.4A U4.V14(IO_L22N_T3_A04_D20_14)
NetR182_1A: R182.1A U4.R15(IO_L13N_T2_MRCC_14)
NetR182_2A: R182.2A U4.P18(IO_L9N_T1_DQS_D13_14)
NetR182_3A: R182.3A U4.N14(IO_L8P_T1_D11_14)
NetR182_4A: R182.4A U4.N16(IO_L11N_T1_SRCC_14)
NetR183_1A: R183.1A U4.L15(IO_L3P_T0_DQS_PUDC_B_14)
NetR183_2A: R183.2A U4.V15(IO_L16P_T2_CSI_B_14)
NetR183_3A: R183.3A U4.R11(IO_0_14)
NetR183_4A: R183.4A U4.T15(IO_L14N_T2_SRCC_14)
NetR184_1A: R184.1A U4.U8(IO_25_34)
NetR184_2A: R184.2A U4.T6(IO_L23N_T3_34)
NetR184_3A: R184.3A U4.V6(IO_L20N_T3_34)
NetR185_1A: R185.1A U4.V10(IO_L21P_T3_DQS_14)
NetR185_2A: R185.2A U4.T9(IO_L24P_T3_A01_D17_14)
NetR185_3A: R185.3A U4.T10(IO_L24N_T3_A00_D16_14)
NetR185_4A: R185.4A U4.V11(IO_L21N_T3_DQS_A06_D22_14)
NetR188_1A: R188.1A U4.T11(IO_L19P_T3_A10_D26_14)
NetR188_2A: R188.2A U4.U12(IO_L20P_T3_A08_D24_14)
NetR188_3A: R188.3A U4.R12(IO_L5P_T0_D06_14)
NetR188_4A: R188.4A U4.U13(IO_L23N_T3_A02_D18_14)
NetR189_1A: R189.1A U4.R10(IO_25_14)
NetR189_2A: R189.2A U4.V12(IO_L20N_T3_A07_D23_14)
NetR189_3A: R189.3A U4.U11(IO_L19N_T3_A09_D25_VREF_14)
NetR189_4A: R189.4A U4.M18(IO_L4N_T0_D05_14)
NetR190_1A: R190.1A U4.U18(IO_L17N_T2_A13_D29_14)
NetR190_2A: R190.2A U4.T16(IO_L15N_T2_DQS_DOUT_CSO_B_14)
NetR190_3A: R190.3A U4.U16(IO_L18P_T2_A12_D28_14)
NetR190_4A: R190.4A U4.T18(IO_L7N_T1_D10_14)
NetR191_1A: R191.1A U4.R16(IO_L15P_T2_DQS_RDWR_B_14)
NetR191_2A: R191.2A U4.R17(IO_L12N_T1_MRCC_14)
NetR191_3A: R191.3A U4.R18(IO_L7P_T1_D09_14)
NetR191_4A: R191.4A U4.P14(IO_L8N_T1_D12_14)

Not connected (* = marked no-connect by the designer): R184 4A 4B

### Notes on the sheet
- This SPI flash can be driven from both the FPGA and from the RP2040. Ideally placed between them with a sort of daisy-chain style routing FPGA-->SPI-->RP2040, as short as possible.
- (near U17) TODO - may be 128 Mbit on final.
- Title:
- Date:
- Rev:
- Time:
- Project:
- Sheet
- of
- License:
- Copyright © NewAE Technology Inc.
- Approved:
- NewAE.com
- File:
- (in symbol CMP-0383-00012-1, part A) BANK 14
- (in symbol CMP-0383-00012-1, part D) BANK 34

### Library data of the parts
C80 = CCHIP-100n-0402: 100n, 0402; Manufacture Part Number 1: CGA2B3X7R1V104K050BB; Component Group: Capacitor; Case-EIA: 0402; Part Number: CCHIP-100n-0402; Footprint: 0402; Pin Count: 2; Supplier 1: Digi-Key; Supplier Part Number 1: 445-6901-1-ND; Value: 100n; Mounting Technology: SMT; Component Kind: Standard; Component Type: Standard
R45 R46 = RCHIP-10K-0402: 10k res, 0402, 1%, 1/16W; Manufacture 1: Yageo; Manufacture Part Number 1: RC0402FR-0710KL; Component Group: Resistor; Case-EIA: 0402; Case-Metric: 1005; Rated Power: 0.063W; Rated Voltage: 75VDC; Part Number: RCHIP-10K-0402; Footprint: 0402; Pin Count: 2; Supplier 1: Digi-Key; Supplier Part Number 1: 311-10.0KLRCT-ND; Value: 10k; Tolerance: 1%; Mounting Technology: SMT; Temperature Range: -55C to 155C; Component Kind: Standard; Component Type: Standard
R47-R52 R168 R169 R171 = RCHIP-22R-0402: 22R res, 0402, 1%, 1/16W; Manufacture 1: Yageo; Manufacture Part Number 1: RC0402FR-0722RL; Component Group: Resistor; Case-EIA: 0402; Case-Metric: 1005; Rated Power: 0.063W; Rated Voltage: 75VDC; Part Number: RCHIP-22R-0402; Footprint: 0402; Pin Count: 2; Supplier 1: Digi-Key; Supplier Part Number 1: 311-22.0LRCT-ND; Value: 22R; Tolerance: 1%; Mounting Technology: SMT; Temperature Range: -55C to 155C; Component Kind: Standard; Component Type: Standard
R170 R175 R177-R185 R188-R191 = 741C083330JP: 33-ohm, 0.5mm res array; Manufacture 1: CTS; Component Group: Resistor; PP Material Stack: 0; Part Number: 741C083330JP; Manufacture Part Number 1: 741C083330JP; Pin Count: 8; Supplier 1: Digi-Key; Supplier Part Number 1: 741C083330JPCT-ND; Mounting Technology: SMT; Component Kind: Standard; Component Type: Standard; PP Rotation: 0; PP Rotation1: 0
R212 = RCHIP-12K-0603: 12k res, 0603, 1%, 1/10W; Manufacture 1: Yageo; Manufacture Part Number 1: RC0603FR-0712KL; Component Group: Resistor; Case-EIA: 0603; Case-Metric: 1608; Rated Power: 0.1W; Rated Voltage: 75VDC; Part Number: RCHIP-12K-0603; Footprint: 0603; Pin Count: 2; Supplier 1: Digi-Key; Supplier Part Number 1: 311-12.0KHRCT-ND; Value: 12k; Tolerance: 1%; Mounting Technology: SMT; Temperature Range: -55C to 155C; Component Kind: Standard; Component Type: Standard
R213 = RCHIP-DNM-0603: Do Not Mount Resistor; Case-EIA: 0603; Case-Metric: 1608; Part Number: RCHIP-DNM-0603; Component Group: Resistor; Footprint: 0603; Pin Count: 2; Mounting Technology: SMT; Component Kind: Standard; Component Type: Standard
U4 = CMP-0383-00012-1: Artix-7 FPGA, 210 User I/Os, 0 GTP, 324-Ball BGA, Speed Grade 1, Commercial Grade, Pb-Free; Manufacturer: Xilinx; GTP: 0; Available User I/O: 210; Speed Grades: 1; Logic Cells: 33280; Total Block RAM: 1800 Kb; CMTs: 5; Maximum Distributed RAM: 400 Kb; ComponentLink2URL: http://www.xilinx.com/support/documentation/data_sheets/ds180_7Series_Overview.pdf; ComponentLink2Description: Datasheet; DatasheetVersion: Rev. 1.15; PackageDescription: 324-Ball Wire-Bond Chip-Scale BGA, Body 15 x 15 mm, Pitch 0.8 mm; ComponentLink4URL: http://www.xilinx.com/support/documentation/user_guides/ug475_7Series_Pkg_Pinout.pdf; PackageReference: CSG-324; Mounting Technology: Surface Mount; PackageVersion: Rev. 1.11; ComponentLink1Description: Manufacturer URL; ComponentLink3Description: Pinout; ComponentLink1URL: http://www.xilinx.com/; ComponentLink3URL: http://www.xilinx.com/support/documentation/user_guides/ug475_7Series_Pkg_Pinout.pdf; PartNumber: XC7A35T-1CSG324C; ComponentLink4Description: Package Specification; Operating Temperature Range: Commercial
U17 = MT25QL256ABA1EW9-0SIT: IC FLASH 256M SPI 133MHZ 8WPDFN; Manufacture 1: Winbond; Component Group: Digital IC; PP Material Stack: 0; Part Number: W25Q256JVEIQ; Footprint: WSON-8x6; Manufacture Part Number 1: W25Q256JVEIQ; Pin Count: 9; Supplier 1: Digi-Key; Mounting Technology: SMT; RoHS: Yes; Component Kind: Standard; Component Type: Standard; PP Rotation: 0; PP Rotation1: 0